# Altium project FT2232H_UART.PrjPcb
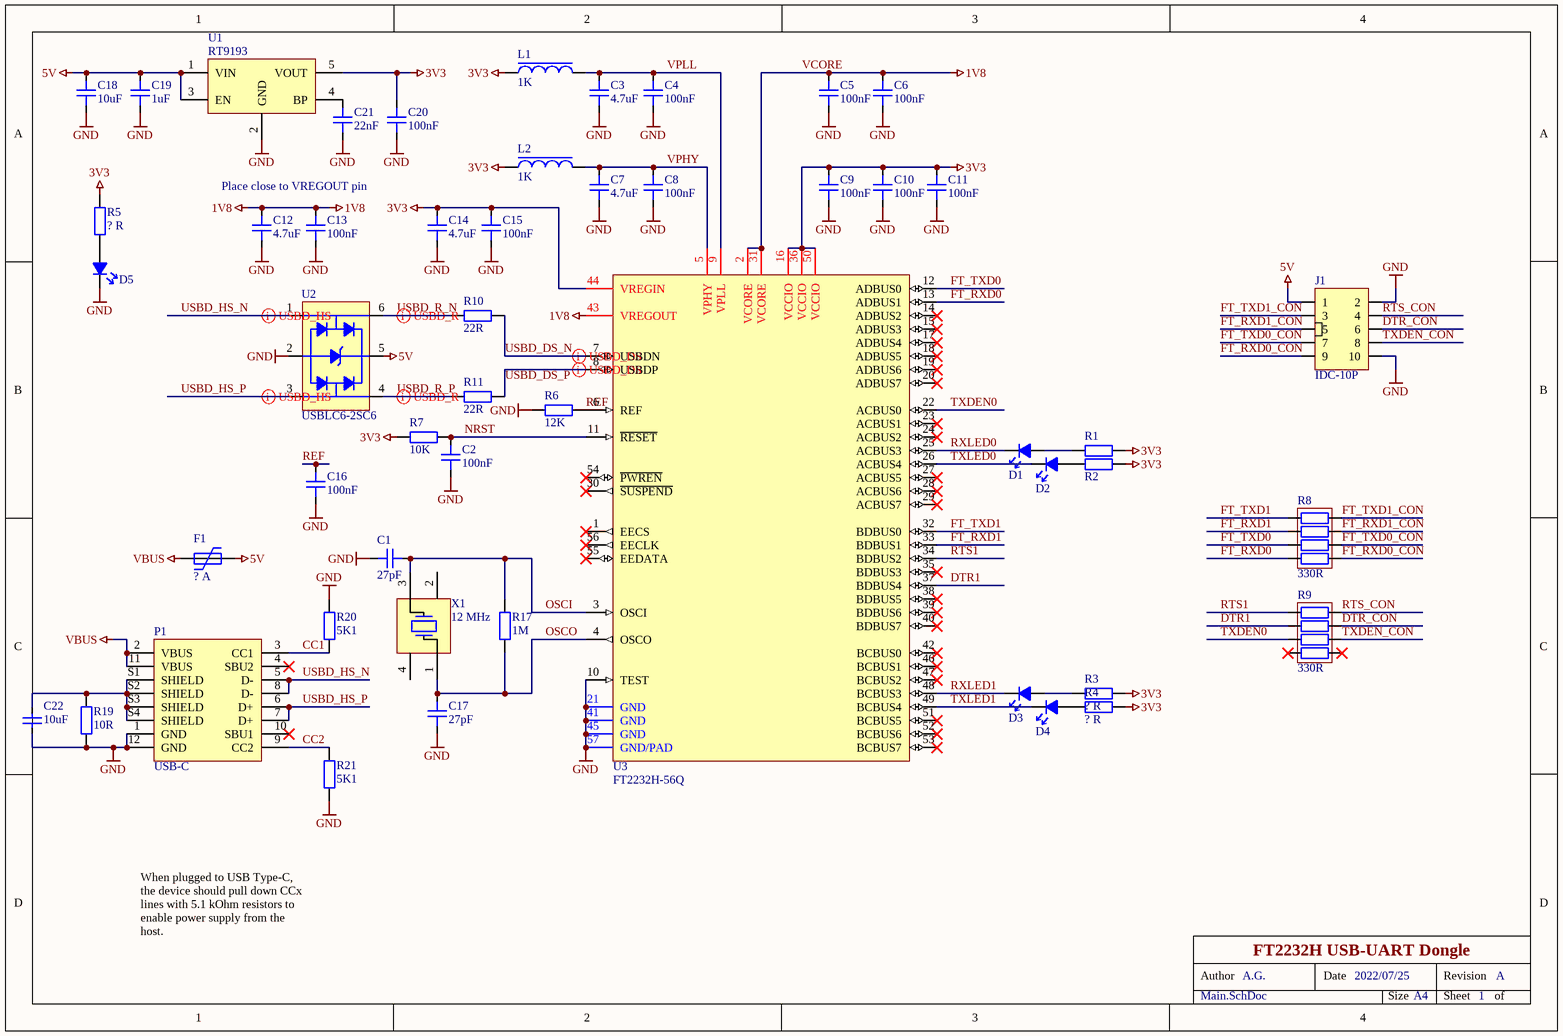
[diagram p0: Main.SchDoc]
Date: 2022/07/25; DrawnBy: A.G.; Revision: A; Title: FT2232H USB-UART Dongle
1 sheet, 51 parts. Net scope: global (net labels, ports and power ports of the same name join across sheets).
Board file: FT2232H_UART.PcbDoc

## Sheet Main.SchDoc: FT2232H USB-UART Dongle
size A4; Date: 2022/07/25; DrawnBy: A.G.; DocumentNumber: 1; Revision: A; SheetNumber: 1; ProjectName: FT2232H_UART.PrjPcb

### Parts
C1  27pF  [0603C_RF_M]
C2  100nF  [0603C_RF_M]
C3  4.7uF  [0603C_RF_M]
C4  100nF  [0603C_RF_M]
C5  100nF  [0603C_RF_M]
C6  100nF  [0603C_RF_M]
C7  4.7uF  [0603C_RF_M]
C8  100nF  [0603C_RF_M]
C9  100nF  [0603C_RF_M]
C10  100nF  [0603C_RF_M]
C11  100nF  [0603C_RF_M]
C12  4.7uF  [0603C_RF_M]
C13  100nF  [0603C_RF_M]
C14  4.7uF  [0603C_RF_M]
C15  100nF  [0603C_RF_M]
C16  100nF  [0603C_RF_M]
C17  27pF  [0603C_RF_M]
C18  10uF  [0603C_RF_M]
C19  1uF  [0603C_RF_M]
C20  100nF  [0603C_RF_M]
C21  22nF  [0603C_RF_M]
C22  10uF  [0603C_RF_M]
D1  Unspecified  [0805LED_RF_M]  (value not drawn)
D2  Unspecified  [0805LED_RF_M]  (value not drawn)
D3  Unspecified  [0805LED_RF_M]  (value not drawn)
D4  Unspecified  [0805LED_RF_M]  (value not drawn)
D5  Unspecified  [0805LED_RF_M]  (value not drawn)
F1  ? A  [PTC_0805_RF_M]
J1  IDC-10P  [IDC-10_100MIL_SIDE]
L1  1K  [0603C_RF_M]
L2  1K  [0603C_RF_M]
P1  USB-C  [USBC-16P-TH]
R1  ? R  [0603R_RF_M]  (value not drawn)
R2  ? R  [0603R_RF_M]  (value not drawn)
R3  ? R  [0603R_RF_M]
R4  ? R  [0603R_RF_M]
R5  ? R  [0603R_RF_M]
R6  12K  [0603R_RF_M]
R7  10K  [0603R_RF_M]
R8  330R  [R0603_ARR_4R_CNVX_RF_H]
R9  330R  [R0603_ARR_4R_CNVX_RF_H]
R10  22R  [R0402_RF_M]
R11  22R  [R0402_RF_M]
R17  1M  [0603R_RF_M]
R19  10R  [0603R_RF_M]
R20  5K1  [0603R_RF_M]
R21  5K1  [0603R_RF_M]
U1  RT9193  [TI_SOT-23-5]
U2  USBLC6-2SC6  [TI_SOT-23-6]
U3  FT2232H-56Q  [FTDI_VQFN-56_RF_M]
X1  12 MHz  [XTAL_3225]

### Nets
3V3: C9.2 C10.2 C11.2 C14.2 C15.2 C20.2 L1.1 L2.1 R1.1 R2.1 R3.1 R4.1 R5.1 R7.1 U1.5(VOUT) U3.16(VCCIO) U3.36(VCCIO) U3.44(VREGIN) U3.50(VCCIO)
5V: C18.1 C19.1 F1.2 J1.1 U1.1(VIN) U1.3(EN) U2.5
GND: C1.1 C2.2 C3.1 C4.1 C5.1 C6.1 C7.1 C8.1 C9.1 C10.1 C11.1 C12.1 C13.1 C14.1 C15.1 C16.2 C17.1 C18.2 C19.2 C20.1 C21.1 C22.1 D5.C J1.2 J1.10 P1.1(GND) P1.12(GND) R6.1 R19.2 R20.1 R21.2 U1.2(GND) U2.2 U3.10(TEST) U3.21(GND) U3.41(GND) U3.45(GND) U3.57(GND/PAD)
VBUS: F1.1 P1.2(VBUS) P1.11(VBUS)
VCORE: C5.2 C6.2 C12.2 C13.2 U3.2(VCORE) U3.31(VCORE) U3.43(VREGOUT)  [also labelled 1V8]
CC1: P1.3(CC1) R20.2
CC2: P1.9(CC2) R21.1
DTR1: R9.2 U3.37(BDBUS4)
DTR_CON: J1.6 R9.7
FT_RXD0: R8.4 U3.13(ADBUS1)
FT_RXD0_CON: J1.9 R8.5
FT_RXD1: R8.2 U3.33(BDBUS1)
FT_RXD1_CON: J1.5 R8.7
FT_TXD0: R8.3 U3.12(ADBUS0)
FT_TXD0_CON: J1.7 R8.6
FT_TXD1: R8.1 U3.32(BDBUS0)
FT_TXD1_CON: J1.3 R8.8
NRST: C2.1 R7.2 U3.11(~{RESET})
OSCI: C1.2 R17.1 U3.3(OSCI) X1.3(X2)
OSCO: C17.2 R17.2 U3.4(OSCO) X1.1(X1)
REF: C16.1 R6.2 U3.6(REF)
RTS1: R9.1 U3.34(BDBUS2)
RTS_CON: J1.4 R9.8
RXLED0: D1.C U3.25(ACBUS3)
RXLED1: D3.C U3.48(BCBUS3)
TXDEN0: R9.3 U3.22(ACBUS0)
TXDEN_CON: J1.8 R9.6
TXLED0: D2.C U3.26(ACBUS4)
TXLED1: D4.C U3.49(BCBUS4)
USBD_DS_N: R10.2 U3.7(USBDN)
USBD_DS_P: R11.2 U3.8(USBDP)
USBD_HS_N: P1.5(D-) P1.8(D-) U2.1
USBD_HS_P: P1.6(D+) P1.7(D+) U2.3
USBD_R_N: R10.1 U2.6
USBD_R_P: R11.1 U2.4
VPHY: C7.2 C8.2 L2.2 U3.5(VPHY)
VPLL: C3.2 C4.2 L1.2 U3.9(VPLL)
NetC21_2: C21.2 U1.4(BP)
NetC22_2: C22.2 P1.S1(SHIELD) P1.S2(SHIELD) P1.S3(SHIELD) P1.S4(SHIELD) R19.1
NetD1_A: D1.A R1.2
NetD2_A: D2.A R2.2
NetD3_A: D3.A R3.2
NetD4_A: D4.A R4.2
NetD5_A: D5.A R5.2

Not connected (* = marked no-connect by the designer): P1 4(SBU2)* 10(SBU1)*; R9 4* 5*; U3 1(EECS)* 14(ADBUS2)* 15(ADBUS3)* 17(ADBUS4)* 18(ADBUS5)* 19(ADBUS6)* 20(ADBUS7)* 23(ACBUS1)* 24(ACBUS2)* 27(ACBUS5)* 28(ACBUS6)* 29(ACBUS7)* 30(~{SUSPEND})* 35(BDBUS3)* 38(BDBUS5)* 39(BDBUS6)* 40(BDBUS7)* 42(BCBUS0)* 46(BCBUS1)* 47(BCBUS2)* 51(BCBUS5)* 52(BCBUS6)* 53(BCBUS7)* 54(~{PWREN})* 55(EEDATA)* 56(EECLK)*; X1 2(GND) 4(GND)

### Layout directives
differential pair: USBD_DS_N, USBD_DS_P, USBD_HS_N, USBD_HS_P, USBD_R_N, USBD_R_P

### Notes on the sheet
- Place close to VREGOUT pin
- When plugged to USB Type-C, the device should pull down CCx lines with 5.1 kOhm resistors to enable power supply from the host.
- Author
- Date
- Revision
- Size
- A4
- Sheet
- of

### Library data of the parts
C1-C11 C13-C22 = C: Capacitor; Manufacturer: Generic Brand; Max Voltage: ? V; Tolerance: ?; Mounting Technology: SMT; Tag: *; Manufacturer Part No: *; Supplier: *; Supplier Link: http://; Supplier Part No: *; Category: Capacitor
  C1 C17: Value: 27pF
  C2 C4-C6 C8-C11 C13 C15 C16 C20: Value: 100nF
  C3 C7 C14: Value: 4.7uF
  C18 C22: Value: 10uF
  C19: Value: 1uF
  C21: Value: 22nF
C12 = C: Capacitor; Manufacturer: Generic Brand; Value: 100nF; Max Voltage: ? V; Tolerance: ?; Mounting Technology: SMT; Tag: *; Manufacturer Part No: *; Supplier: *; Supplier Link: http://; Supplier Part No: *; Category: Capacitor
D1-D5 = LED: Manufacturer: Generic Brand; Forward Voltage Drop: ? V; Emitting Color: Unspecified; Manufacturer Part No: *; Supplier: *; Supplier Link: http://; Supplier Part No: *; Category: Diode; Mounting Technology: SMT
F1 = PPTC: Resettable Fuse; Manufacturer: Generic Brand; Max Voltage: ? V; Hold Current: ? A; Category: Fuse; Mounting Technology: SMT; Supplier Link: http://
J1 = IDC-10P: IDC Connector Header Double Row 10 Position; Manufacturer: Wurth Elektronik; Manufacturer Part No: 61201021621; Supplier Part No: 732-2094-ND; Supplier: DigiKey; Supplier Link: https://www.digikey.com/en/products/detail/würth-elektronik/61201021621/2060590; Mounting Technology: THT
L1 L2 = FB: Ferrite Bead; Value: 1K; Mounting Technology: SMT; Category: Inductance/Fixed
P1 = USBC-16P-TH: USB Type C Socket 16-Pin
R1-R7 R10 R11 R17 R19-R21 = R: Resistor; Manufacturer: Generic Brand; Power Rating: ? W; Max Voltage: ? V; Tolerance: ?; Supplier Link: http://; Category: Resistor; Mounting Technology: SMT
  R1-R5: Value: ? R
  R6: Value: 12K
  R7: Value: 10K
  R10 R11: Value: 22R
  R17: Value: 1M
  R19: Value: 10R
  R20 R21: Value: 5K1
R8 R9 = RA-4: Resistor Array 4x Isolated; Value: 330R
U1 = RT9193: IC REG LINEAR 300MA SOT23-5; Output Voltage: ? V; Part Number: *; Supplier: *
U2 = USBLC6-2SC6: Low Capacitance USB ESD Protection; Manufacturer: STMicroelectronics; Supplier Link: https://www.chipdip.by/product/usblc6-2sc6; Supplier Part No: 9000039051; Supplier: Chipdip; Case: SOT-23-6; Mounting Type: SMT; Product Name: USBLC6-2SC6
U3 = FT2232H-56Q: IC DUAL USB TO UART/FIFO 56VQFN; Manufacturer: Future Technology Devices International Ltd; Product Number: FT2232H-56Q-TRAY; Package: VQFN-56; Supplier: DigiKey; Supplier Link: https://www.digikey.com/en/products/detail/ftdi-future-technology-devices-international-ltd/FT2232H-56Q-TRAY/5994773; Supplier Part No: 768-1276-ND; Mounting Technology: SMT; Datasheet: https://www.ftdichip.com/Support/Documents/DataSheets/ICs/DS_FT2232H.pdf; Category: IC
X1 = XT-4P: Crystal Resonator (4 Leads); Manufacturer: Generic Brand; Tolerance: ? ppm; Mounting Technology: SMT; Supplier Link: http://; Category: Crystal; Value: 12 MHz